# EAGLE design pulser 5 (EAGLE 7.7.0)
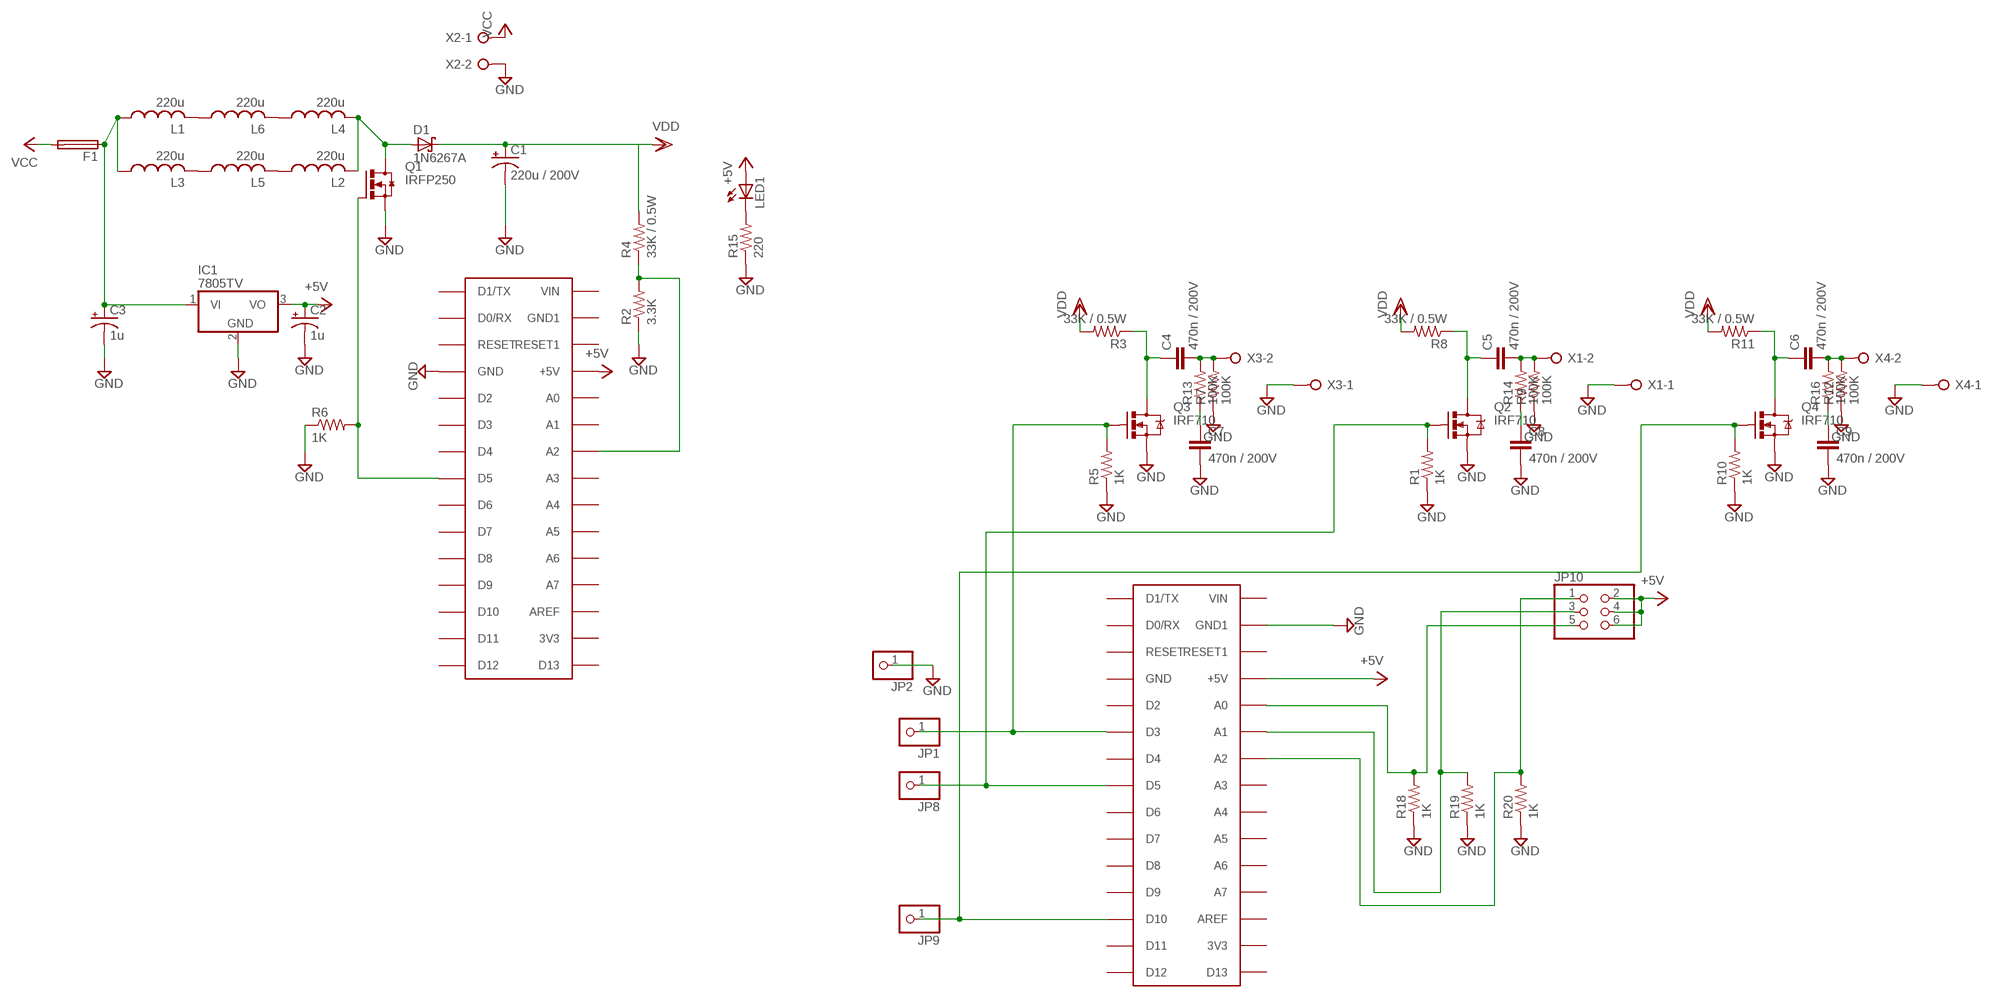
[diagram p0: schematic, sheet 1]

## Parts
C1  220u / 200V  CPOL-USE7.5-18  [E7,5-18]
C2  1u  CPOL-USE2.5-6  [E2,5-6]
C3  1u  CPOL-USE2.5-6  [E2,5-6]
C4  470n / 200V  C-EU150-064X183  [C150-064X183]
C5  470n / 200V  C-EU150-064X183  [C150-064X183]
C6  470n / 200V  C-EU150-064X183  [C150-064X183]
C7  470n / 200V  C-EU150-064X183  [C150-064X183]
C8  470n / 200V  C-EU150-064X183  [C150-064X183]
C9  470n / 200V  C-EU150-064X183  [C150-064X183]
D1  1N6267A  [C4111-15]
F1  TE5  [TE5]
IC1  7805TV  [TO220V]
JP1  PINHD-1X1  [1X01]
JP2  PINHD-1X1  [1X01]
JP8  PINHD-1X1  [1X01]
JP9  PINHD-1X1  [1X01]
JP10  PINHD-2X3  [2X03]
L1  220u  L-USLAP02KR  [LAP02KR]
L2  220u  L-USLAP02KR  [LAP02KR]
L3  220u  L-USLAP02KR  [LAP02KR]
L4  220u  L-USLAP02KR  [LAP02KR]
L5  220u  L-USLAP02KR  [LAP02KR]
L6  220u  L-USLAP02KR  [LAP02KR]
LED1  LED5MM  [LED5MM]
Q1  IRFP250  [TO-247AD-V]
Q2  IRF710  MOSFET-NCHANNELFQP30N06L  [TO220V]
Q3  IRF710  MOSFET-NCHANNELFQP30N06L  [TO220V]
Q4  IRF710  MOSFET-NCHANNELFQP30N06L  [TO220V]
R1  1K  R-US_0207/10  [0207/10]
R2  3.3K  R-US_0207/10  [0207/10]
R3  33K / 0.5W  R-US_0309/12  [0309/12]
R4  33K / 0.5W  R-US_0309/12  [0309/12]
R5  1K  R-US_0207/10  [0207/10]
R6  1K  R-US_0207/10  [0207/10]
R7  100K  R-US_0207/10  [0207/10]
R8  33K / 0.5W  R-US_0309/12  [0309/12]
R9  100K  R-US_0207/10  [0207/10]
R10  1K  R-US_0207/10  [0207/10]
R11  33K / 0.5W  R-US_0309/12  [0309/12]
R12  100K  R-US_0207/10  [0207/10]
R13  100K  R-US_0207/10  [0207/10]
R14  100K  R-US_0207/10  [0207/10]
R15  220  R-US_0207/10  [0207/10]
R16  100K  R-US_0207/10  [0207/10]
R18  1K  R-US_0207/10  [0207/10]
R19  1K  R-US_0207/10  [0207/10]
R20  1K  R-US_0207/10  [0207/10]
U$1  ARDUINONANO  [PDIP-32]
U$2  ARDUINONANO  [PDIP-32]
X1  W237-02P  [W237-132]
X2  W237-02P  [W237-132]
X3  W237-02P  [W237-132]
X4  W237-02P  [W237-132]

## Nets
+5V: C2.+ IC1.3(VO) JP10.2 JP10.4 JP10.6 LED1.A U$1.+5V U$2.+5V
GND: C1.- C2.- C3.- C7.2 C8.2 C9.2 IC1.2(GND) JP2.1 Q1.S Q2.3(S) Q3.3(S) Q4.3(S) R1.1 R2.1 R5.1 R6.1 R7.1 R9.1 R10.1 R12.1 R15.1 R18.1 R19.1 R20.1 U$1.GND U$2.GND1 X1.1 X2.2 X3.1 X4.1
N$1: C3.+ F1.1 IC1.1(VI) L1.1 L3.1
N$2: D1.A L2.2 L4.2 Q1.D
N$3: C4.1 Q3.2(D) R3.1
N$4: JP1.1 Q3.1(G) R5.2 U$2.D3
N$5: C4.2 R7.2 R13.2 X3.2
N$6: LED1.K(C) R15.2
N$7: R2.2 R4.1 U$1.A2
N$8: L3.2 L5.1
N$9: Q1.G R6.2 U$1.D5
N$10: C5.1 Q2.2(D) R8.1
N$11: L4.1 L6.2
N$12: JP8.1 Q2.1(G) R1.2 U$2.D5
N$13: JP9.1 Q4.1(G) R10.2 U$2.D10
N$14: C5.2 R9.2 R14.2 X1.2
N$15: C6.1 Q4.2(D) R11.1
N$16: C7.1 R13.1
N$17: JP10.5 R18.2 U$2.A0
N$18: L2.1 L5.2
N$19: C6.2 R12.2 R16.2 X4.2
N$20: C8.1 R14.1
N$21: L1.2 L6.1
N$22: C9.1 R16.1
N$24: JP10.3 R19.2 U$2.A1
N$25: JP10.1 R20.2 U$2.A2
VCC: F1.2 X2.1
VDD: C1.+ D1.C R3.2 R4.2 R8.2 R11.2
Unconnected: U$1.3V3 U$1.A0 U$1.A1 U$1.A3 U$1.A4 U$1.A5 U$1.A6 U$1.A7 U$1.AREF U$1.D0/RX U$1.D1/TX U$1.D2 U$1.D3 U$1.D4 U$1.D6 U$1.D7 U$1.D8 U$1.D9 U$1.D10 U$1.D11 U$1.D12 U$1.D13 U$1.GND1 U$1.RESET U$1.RESET1 U$1.VIN U$2.3V3 U$2.A3 U$2.A4 U$2.A5 U$2.A6 U$2.A7 U$2.AREF U$2.D0/RX U$2.D1/TX U$2.D2 U$2.D4 U$2.D6 U$2.D7 U$2.D8 U$2.D9 U$2.D11 U$2.D12 U$2.D13 U$2.GND U$2.RESET U$2.RESET1 U$2.VIN

## Library data of the parts
C1-C3 = rcl:CPOL-US: POLARIZED CAPACITOR, American symbol
C4-C9 = rcl:C-EU: CAPACITOR, European symbol
D1 = diode:1N6267A: DIODE transient voltage suppressor
F1 = fuse:TE5: FUSE Wickmann; OC_FARNELL: unknown; OC_NEWARK: unknown
IC1 = linear:78*: Positive VOLTAGE REGULATOR Source: http://cache.national.com/ds/LM/LM78L05.pdf http://www.fairchildsemi.com/ds/LM/LM7805.pdf
JP1 JP2 JP8 JP9 = pinhead:PINHD-1X1: PIN HEADER
JP10 = pinhead:PINHD-2X3: PIN HEADER
L1-L6 = rcl:L-US: INDUCTOR, American symbol
LED1 = led:LED: LED OSRAM: - CHIPLED LG R971, LG N971, LY N971, LG Q971, LY Q971, LO R971, LY R971 LH N974, LH R974 LS Q976, LO Q976, LY Q976 LO Q996 - Hyper CHIPLED LW Q18S LB Q993, LB Q99A, LB R99A - SideLED LS A670, LO A670, LY A670, LG A670, LP A670 LB A673, LV A673, LT A673, LW A673 LH A674 LY A675 LS A676, LA A676, LO A676, LY A676, LW A676 LS A679, LY A679, LG A679 - Hyper Micro SIDELED® LS Y876, LA Y876, LO Y876, LY Y876 LT Y87S - SmartLED LW L88C, LW L88S LB L89C, LB L89S, LG L890 LS L89K, LO L89K, LY L89K LS L896, LA L896, LO L896, LY L896 - TOPLED LS T670, LO T670, LY T670, LG T670, LP T670 LSG T670, LSP T670, LSY T670, LOP T670, LYG T670 LG T671, LOG T671, LSG T671 LB T673, LV T673, LT T673, LW T673 LH T674 LS T676, LA T676, LO T676, LY T676, LB T676, LH T676, LSB T676, LW T676 LB T67C, LV T67C, LT T67C, LS T67K, LO T67K, LY T67K, LW E67C LS E67B, LA E67B, LO E67B, LY E67B, LB E67C, LV E67C, LT E67C LW T67C LS T679, LY T679, LG T679 LS T770, LO T770, LY T770, LG T770, LP T770 LB T773, LV T773, LT T773, LW T773 LH T774 LS E675, LA E675, LY E675, LS T675 LS T776, LA T776, LO T776, LY T776, LB T776 LHGB T686 LT T68C, LB T68C - Hyper Mini TOPLED® LB M676 - Mini TOPLED Santana® LG M470 LS M47K, LO M47K, LY M47K Source: http://www.osram.convergy.de LUXEON: - LUMILED® LXK2-PW12-R00, LXK2-PW12-S00, LXK2-PW14-U00, LXK2-PW14-V00 LXK2-PM12-R00, LXK2-PM12-S00, LXK2-PM14-U00 LXK2-PE12-Q00, LXK2-PE12-R00, LXK2-PE12-S00, LXK2-PE14-T00, LXK2-PE14-U00 LXK2-PB12-K00, LXK2-PB12-L00, LXK2-PB12-M00, LXK2-PB14-N00, LXK2-PB14-P00, LXK2-PB14-Q00 LXK2-PR12-L00, LXK2-PR12-M00, LXK2-PR14-Q00, LXK2-PR14-R00 LXK2-PD12-Q00, LXK2-PD12-R00, LXK2-PD12-S00 LXK2-PH12-R00, LXK2-PH12-S00 LXK2-PL12-P00, LXK2-PL12-Q00, LXK2-PL12-R00 Source: www.luxeon.com KINGBRIGHT: KA-3528ASYC Source: www.kingbright.com
Q1 = transistor-power:IRFP25*: 33A/27A, 200V/150V, 0.085/0.012 Ohm, N-Channel Power MOSFET Source: Fairchild Semiconductor Corporation
Q2-Q4 = SparkFun-DiscreteSemi:MOSFET-NCHANNEL: Common NMOSFET Parts MFG P/N Store ID Prod ID FDD8780 TRANS-09984 SI7820DN TRANS-11055 FDS6630A IC-08089 2N7002PW TRANS-11151 FQP30N06L COM-10213 TRANS-10060 BSS123LT1G TRANS-08345 BSS138 TRANS-00830 BS170 2N7000; PROD_ID: TRANS-10060
R1-R16 R18-R20 = rcl:R-US_: RESISTOR, American symbol
U$1 U$2 = jet-lib:ARDUINONANO
X1-X4 = con-wago-508:W237-02P: WAGO SREW CLAMP; OC_FARNELL: unknown; OC_NEWARK: unknown

## Board
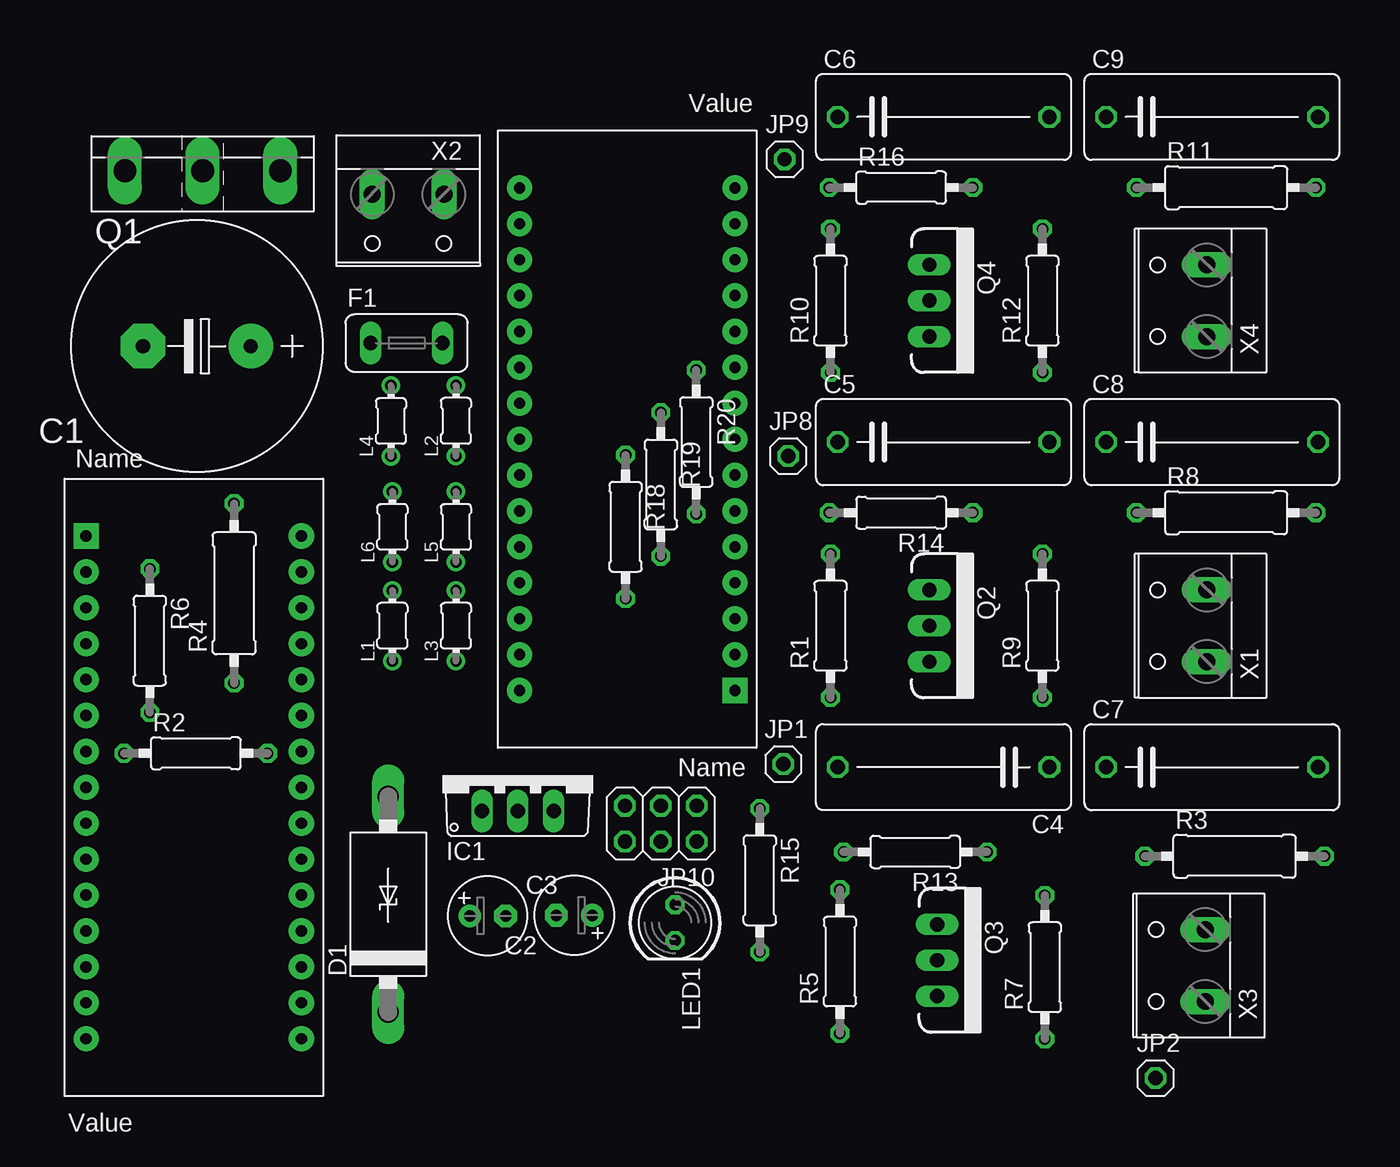
[diagram p1: board, top side]
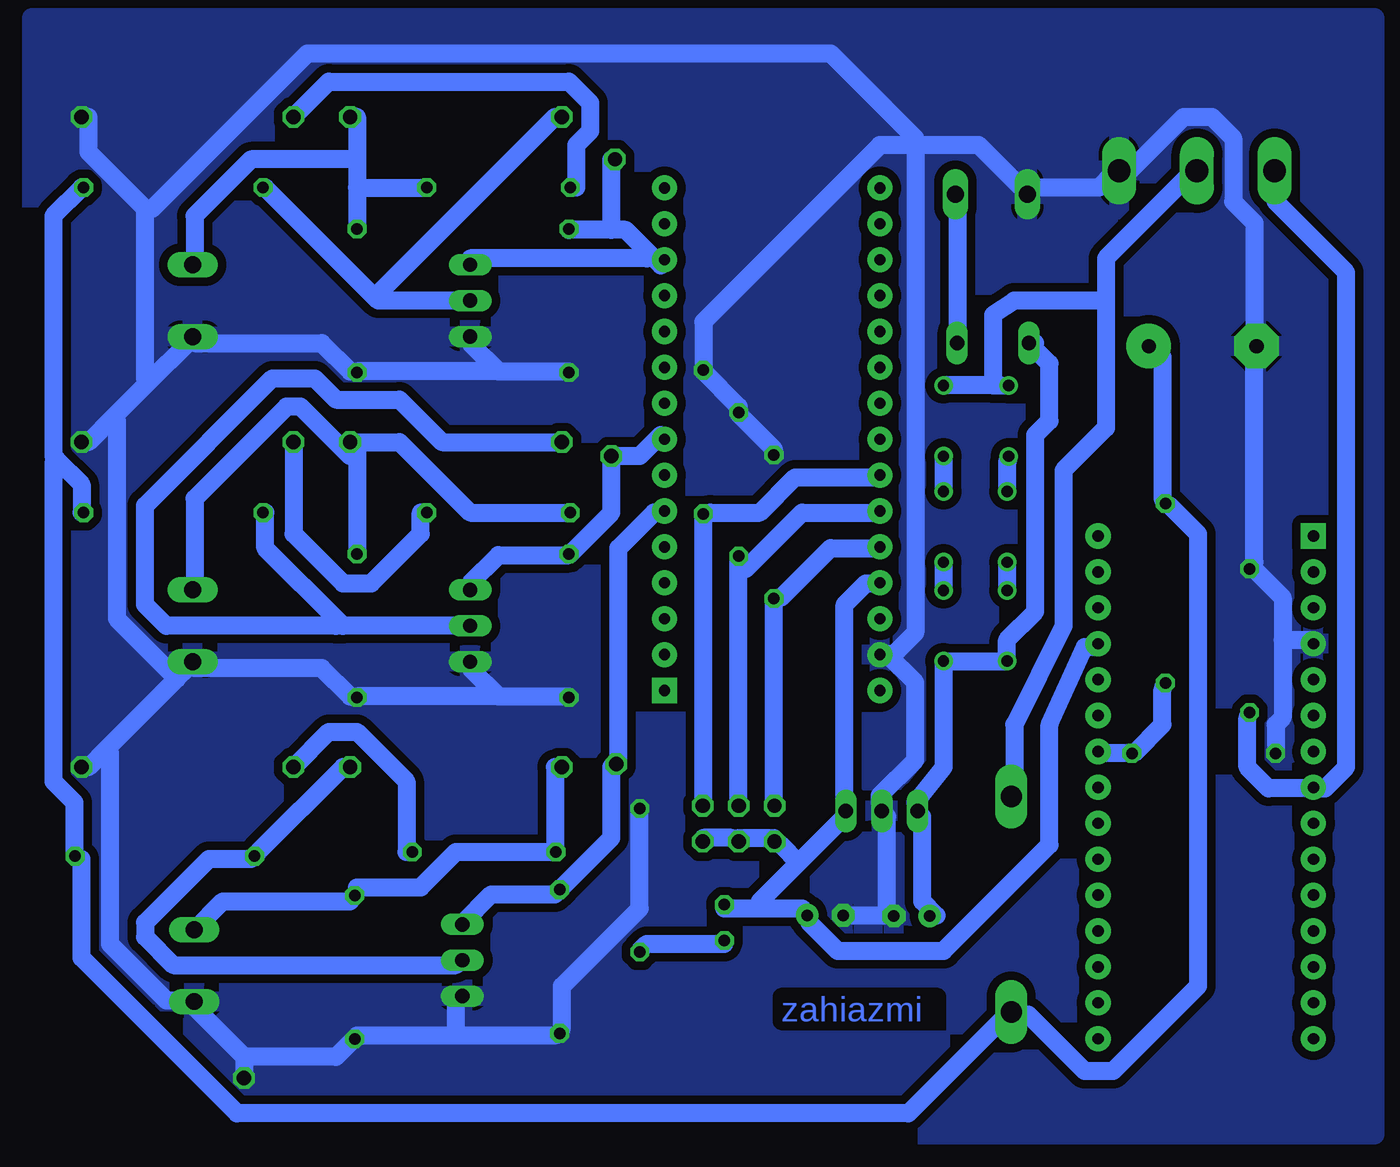
[diagram p2: board, bottom side, seen from below]

No outline drawn. Coordinates in mm, seen from the top.
Copper layers (1*16): Top 0.035mm / dielectric 1.5mm / Bottom 0.035mm
Design rules "default *": minimum track width 50mil, minimum drill 24mil, track to track 24mil, track to pad 24mil, pad to pad 8mil, via to via 8mil, smd to smd 8mil, copper to edge 40mil, drill to drill 8mil, minimum pad ring 10mil, minimum via ring 8mil, stop-mask expansion 4mil, vias tented up to drill 0mil, thermal gap 10mil

### Footprints (pad centres in the part's own frame; a part is rotated, then mirrored left to right if it is on the bottom)
E7,5-18 = drill 1.016 pad 3.15: + -3.81,0 | drill 1.016 pad 3.15 octagon: - 3.81,0
E2,5-6 = drill 0.813 pad 1.6: + -1.27,0 | drill 0.813 pad 1.6 octagon: - 1.27,0
C150-064X183 = drill 1.016 octagon: 1 -7.493,0; 2 7.493,0
C4111-15 = drill 1.499 long: A 7.62,0; C -7.62,0
TE5 = drill 1.016 long: 1 -2.54,0; 2 2.54,0
TO220V = drill 1.016 long: 1 -2.54,-2.54; 2 0,-2.54; 3 2.54,-2.54
1X01 = drill 1.016 octagon: 1 0,0
2X03 = drill 1.016 octagon: 1 -2.54,-1.27; 2 -2.54,1.27; 3 0,-1.27; 4 0,1.27; 5 2.54,-1.27; 6 2.54,1.27
LAP02KR = drill 0.8 pad 1.3: 1 -2.5,0; 2 2.5,0
LED5MM = drill 0.813 octagon: A -1.27,0; K 1.27,0
TO-247AD-V = drill 1.6 long: D 0,-2.54; G -5.5,-2.54; S 5.5,-2.54
TO220V' = drill 1.016 long: 1 -2.54,0; 2 0,0; 3 2.54,0
0207/10 = drill 0.813 octagon: 1 -5.08,0; 2 5.08,0
0309/12 = drill 0.813 octagon: 1 -6.35,0; 2 6.35,0
PDIP-32 = drill 0.8 pad 1.778: 3V3 15.24,-35.56; +5V 15.24,-10.16; A0 15.24,-12.7; A1 15.24,-15.24; A2 15.24,-17.78; A3 15.24,-20.32; A4 15.24,-22.86; A5 15.24,-25.4; A6 15.24,-27.94; A7 15.24,-30.48; AREF 15.24,-33.02; D0/RX 0,-5.08; D2 0,-12.7; D3 0,-15.24; D4 0,-17.78; D5 0,-20.32; D6 0,-22.86; D7 0,-25.4; D8 0,-27.94; D9 0,-30.48; D10 0,-33.02; D11 0,-35.56; D12 0,-38.1; D13 15.24,-38.1; GND 0,-10.16; GND1 15.24,-5.08; RESET 0,-7.62; RESET1 15.24,-7.62; VIN 15.24,-2.54 | drill 0.8 pad 1.778 square: D1/TX 0,-2.54
W237-132 = drill 1.194 long: 1 -2.54,-0.635; 2 2.54,-0.635

### Placement (x,y rotation side)
C1  45.16,53.78 180 top
C2  71.87,13.52 180 top
C3  65.74,13.48 0 top
C4  98,24 180 top
C5  98,47 0 top
C6  98,70 0 top
C7  117,24 0 top
C8  117,47 0 top
C9  117,70 0 top
D1  58.7,14.3 90 top
F1  60,54 0 top
IC1  67.87,23.44 0 top
JP1  86.66,24.21 0 top
JP2  113,2 0 top
JP8  87,46 0 top
JP9  86.75,67 0 top
JP10  78,20 180 top
L1  59,34 90 top
L2  63.5,48.5 90 top
L3  63.5,34 90 top
L4  58.9,48.49 90 top
L5  63.5,41 90 top
L6  59,41 90 top
LED1  79,13 270 top
Q1  45.57,68.73 0 top
Q2  IRF710  [TO220V']  97,34 270 top
Q3  IRF710  [TO220V']  97.54,10.34 270 top
Q4  IRF710  [TO220V']  97,57 270 top
R1  90,34 90 top
R2  45.09,24.98 0 top
R3  118.6,17.7 0 top
R4  47.8,36.3 90 top
R5  90.67,10.25 90 top
R6  41.83,32.95 270 top
R7  105.17,9.85 90 top
R8  118,42 0 top
R9  105,34 90 top
R10  90,57 90 top
R11  118,65 0 top
R12  105,57 90 top
R13  96,18 180 top
R14  95,42 180 top
R15  85,16 270 top
R16  95,65 0 top
R18  75.5,41 270 top
R19  78,44 270 top
R20  80.5,47 270 top
U$1  37.32,42.89 0 top
U$2  83.24,26.88 180 top
X1  116,34 90 top
X2  60.11,63.89 180 top
X3  115.89,9.96 90 top
X4  116,57 90 top

### Tracks (layer width: path | path; a pad name or v marks a point on that pad's centre or on a via)
+5V
  Bottom 1.27: JP10.2 80.5,19 78.5,19 JP10.4 78,19 75.5,19 JP10.6 75,18.5 73.75,17.25 | 76.5,14 73.5,14 C2.+ 73,13 71,11 63.5,11 56,18.5 56,27 53.5,32.5 53,32.5 U$1.+5V | 76.5,14 79,14 LED1.A | 73.75,17.25 76.5,14.5 76.5,14 | 73.75,17.25 70.5,20.5 IC1.3 70.5,21.5 70.5,35.5 69,37 68,37 U$2.+5V
GND
  Bottom 1.27: 39.5,33 39.5,36 41.5,38 R6.1 41.5,38.5 41.5,53.5 C1.- 41.5,54 41.5,62.5 43,64 43,68.5 44.5,70 46.5,70 50.5,66 Q1.S 51.5,66 52.5,65 57.5,65 X2.2 58,65 61,68 65.5,68 | 39.5,33 39.5,27.5 40,27 40,25 R2.1 | 39.5,33 37.5,33 U$1.GND | 67.5,13.5 67.5,20.5 IC1.2 68,21.5 68,22 65.5,24.5 65.5,30 67.5,32 | 67.5,13.5 C3.- | 67.5,13.5 70.5,13.5 C2.- | 67.5,32 68,32 U$2.GND1 | R18.1 75.5,46.5 78,49 R19.1 78,49.5 80.5,52 R20.1 80.5,55.5 68,68 65.5,68 | 65.5,68 65.5,33.5 67,32 67.5,32 | 113,3.5 JP2.1 | 113,3.5 116.5,7 X3.1 117,7.5 118.5,7.5 122.5,11.5 122.5,25 122.75,25.25 | R15.1 85,14 90.5,8.5 90.5,5.5 R5.1 91,5 98,5 | 98,5 105,5 R7.1 105.5,4.5 106.5,3.5 113,3.5 | 98,5 98,7.5 Q3.3 | 117.75,30.25 117,31 X1.1 116.5,31 107.5,31 105.5,29 R9.1 105,29 95,29 | 117.75,30.25 122.75,25.25 | 122.75,25.25 124,24 C7.2 | 95,29 90,29 R1.1 | 95,29 97,31 Q2.3 | 95,52 90,52 R10.1 | 95,52 97,54 Q4.3 | 95,52 105,52 R12.1 105.5,52 107.5,54 116.5,54 X4.1 117,54 119.75,51.25 | 119.75,51.25 122.25,48.75 | 122.25,48.75 124,47 C8.2 | 120,63.5 124,67.5 124,70 C9.2 | 120,63.5 120,51.5 119.75,51.25 | 117.75,30.25 122,34.5 122,48.5 122.25,48.75 | 65.5,68 65.5,68.5 71.5,74.5 108.5,74.5 119.5,63.5 120,63.5
  pour Bottom: 33,75 33,-2 128,-2 128,75 128,77 33,77
N$1
  Bottom 1.27: C3.+ 64,13.5 65,14.5 65,20.5 IC1.1 65.5,21.5 63.5,24 L3.1 L1.1 59,33 57,35 57,47.5 56,48.5 56,52.54 F1.1 57,54
N$2
  Bottom 1.27: 52,57 52,60 46,66 Q1.D | 52,57 52,48 55,45 55,34 58.5,27 58.5,22 D1.A | 60,51 60,56 58.5,57 52,57 | 60,51 59.41,51 L4.2 | 60,51 L2.2
N$3
  Bottom 1.27: C4.1 106,24 112,18 R3.1 112.5,17.5 115.5,17.5 120,13 120,12 118,10 98,10 Q3.2
N$4
  Bottom 1.27: Q3.1 97.5,13 95.5,15 91,15 R5.2 87,19 87,24 JP1.1 86.5,24.5 86.5,39.5 84,42 83.5,42 U$2.D3
N$5
  Bottom 1.27: C4.2 91,24 91,18 R13.2 98,18 100.5,15.5 105,15.5 R7.2 105.5,14.5 114.5,14.5 116.5,12.5 X3.2
N$6
  Bottom 1.27: LED1.K 79,11.5 84.5,11.5 85,11 R15.2
N$7
  Bottom 1.27: R4.1 48,29.5 48,27 50,25 R2.2 50.5,25 52.5,25 U$1.A2
N$8
  Bottom 1.27: L5.1 L3.2
N$9
  Bottom 1.27: R6.2 42,27.5 42,24 40.5,22.5 37.5,22.5 U$1.D5 37,22.5 36.5,22.5 35,24 35,59 40,64 40,66 Q1.G
N$10
  Bottom 1.27: 106.25,34.25 106,34 Q2.2 | 106.25,34.25 111.5,39.5 111.5,42 R8.1 | C5.1 99,47 102,50 106.5,50 108,51.5 111,51.5 120,42.5 120,35.5 118.5,34 106.5,34 106.25,34.25
N$11
  Bottom 1.27: L4.1 59.01,45.49 L6.2
N$12
  Bottom 1.27: U$2.D5 83.5,47.5 85,46 JP8.1 87,42 90,39 | 90,39 95,39 97,37 Q2.1 | 90,39 R1.2
N$13
  Bottom 1.27: 87,62 86,62 84.25,60.25 | 87,62 90,62 R10.2 | 84.25,60.25 83.5,59.5 U$2.D10 | 87,62 87,67 JP9.1 | Q4.1 97,60 84.5,60 84.25,60.25
N$14
  Bottom 1.27: R14.2 97,42 102,47 C5.2 105,46.5 105,46 | 105,46 R9.2 | X1.2 116.5,37 116.5,43 110,49.5 109,49.5 105.5,46 105,46
N$15
  Bottom 1.27: 103.75,57.25 103.5,57 Q4.2 | 103.75,57.25 111.5,65 R11.1 | 103.75,57.25 91,70 C6.1
N$16
  Bottom 1.27: R13.1 101.5,18 101.5,23 105,26.5 107,26.5 C7.1
N$17
  Bottom 1.27: JP10.5 75.5,21.5 R18.2 75,36 71.5,39.5 68,39.5 U$2.A0
N$18
  Bottom 1.27: L2.1 L5.2
N$19
  Bottom 1.27: 105,67 105,70 C6.2 | 105,67 105,65 | 105,65 R12.2 | 105,65 R16.2 | 105,67 112.5,67 116.5,63 116.5,60 X4.2
N$20
  Bottom 1.27: R14.1 100.5,42 100.5,40.5 104,37 106,37 109.5,40.5 C8.1
N$21
  Bottom 1.27: L6.1 L1.2
N$22
  Bottom 1.27: R16.1 89.5,65 89.5,68 88.5,69 88.5,71 90,72.5 107,72.5 C9.1
N$24
  Bottom 1.27: JP10.3 78,38 | 78,38 R19.2 | U$2.A1 68,42 73.5,42 77.5,38 78,38
N$25
  Bottom 1.27: JP10.1 80.5,21.5 R20.2 80,42 76.5,42 74,44.5 68,44.5 U$2.A2
VCC
  Bottom 1.27: F1.2 62.5,54 62.5,64.5 X2.1
VDD
  Bottom 1.27: 126.25,45.75 126.5,46 126.5,63 124.5,65 R11.2 | 126.25,45.75 124.5,44 124.5,42 R8.2 | 126.25,45.75 126.5,45.5 126.5,23 125,21.5 125,18 R3.2 124.5,17.5 124.5,10.5 113.5,-0.5 66,-0.5 59,6.5 D1.C 58.5,6.5 57.5,6.5 53.5,2.5 51.5,2.5 45.5,8.5 45.5,40.5 47.5,42.5 R4.2 48,43 48,53 48.5,53.5 C1.+

### Text on the board
Bottom: zahiazmi